# Altium schematic sheet IOconnector.SchDoc
size B
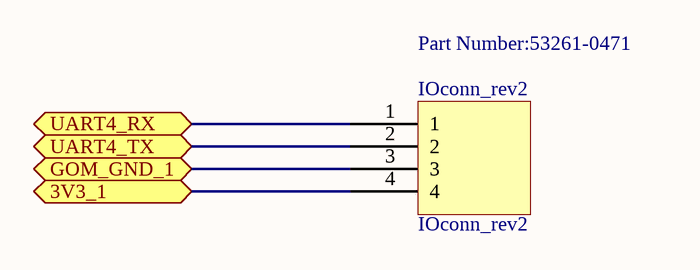
[diagram p0: IOconnector.SchDoc]

## Parts
IOconn_rev2  IOconn_rev2  [IOConn_Rev2]

## Ports
3V3_1 (bidir), GOM_GND_1 (bidir), UART4_RX (bidir), UART4_TX (bidir)

## Nets
3V3_1: IOconn_rev2.4 ; port 3V3_1
GOM_GND_1: IOconn_rev2.3 ; port GOM_GND_1
UART4_RX: IOconn_rev2.1 ; port UART4_RX
UART4_TX: IOconn_rev2.2 ; port UART4_TX

## Notes on the sheet
- (near IOconn_rev2) Part Number:53261-0471

## Library data of the parts
IOconn_rev2 = IOconn_rev2: Part Number: 53261-0471